# Altium schematic sheet Control.SchDoc
size A; Engineer: Will Snyder; Revision: 1.0; SheetNumber: 1; SheetTotal: 2; DocumentTItle: MCU, Power, and IO
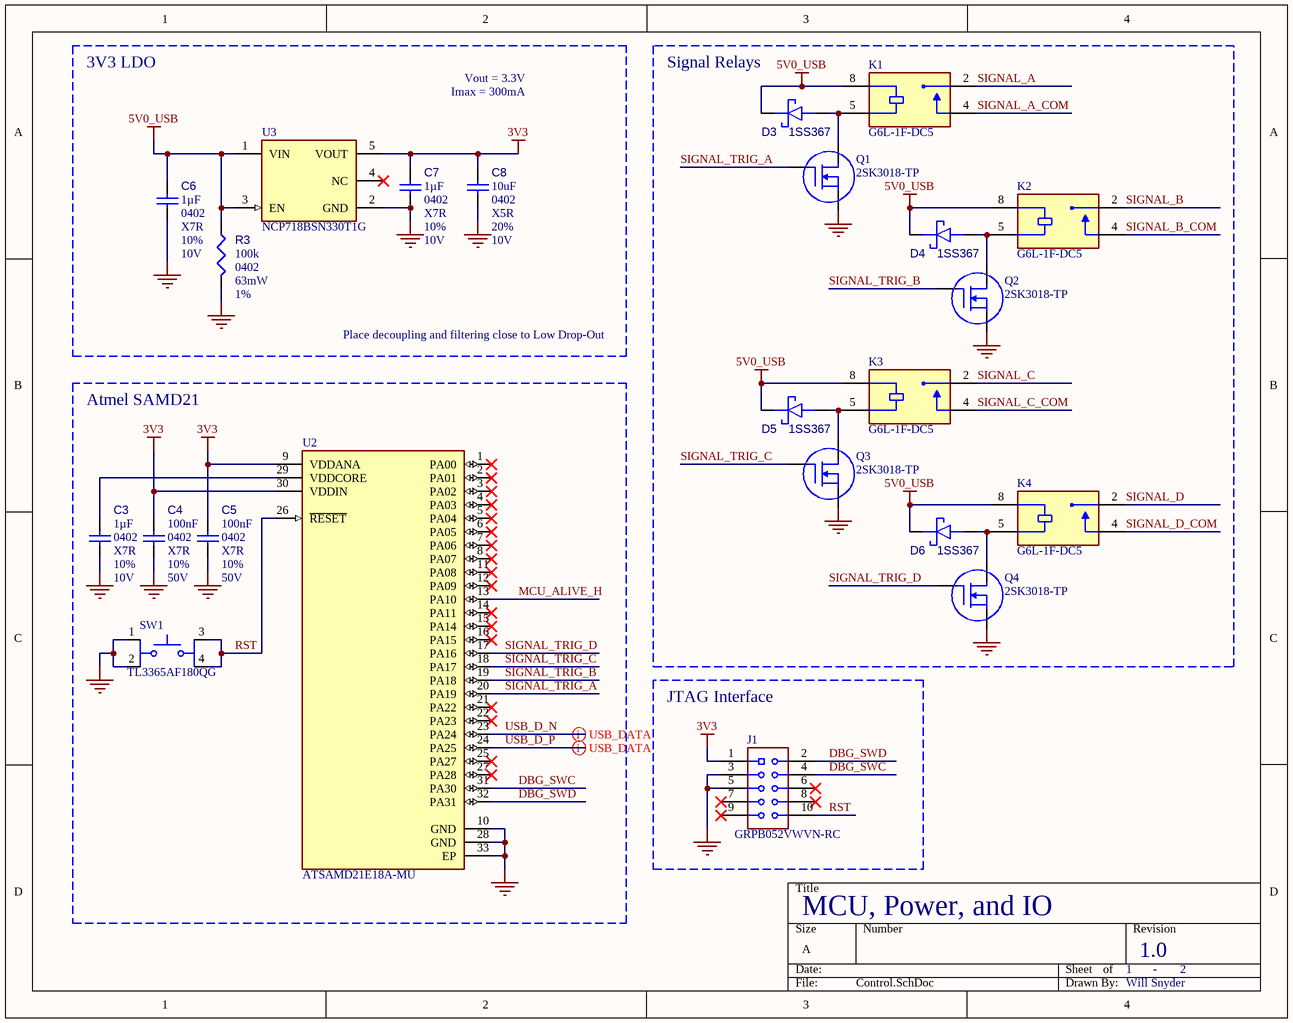
[diagram p0: Control.SchDoc]

## Parts
C3  value 1µF  Case/Package: 0402  Voltage Rating: 10V  Capacitor Type: X7R  Tolerance: 10%  [CAPC1005X55X30NL05T10]  (hidden comment: GRM155Z71A105KE01D)
C4  value 100nF  Voltage Rating: 50V  Capacitor Type: X7R  Case/Package: 0402  Tolerance: 10%  [CAPC1005X55X30NL05T10]  (hidden comment: 04025C104KAT4A)
C5  value 100nF  Voltage Rating: 50V  Capacitor Type: X7R  Case/Package: 0402  Tolerance: 10%  [CAPC1005X55X30NL05T10]  (hidden comment: 04025C104KAT4A)
C6  value 1µF  Case/Package: 0402  Voltage Rating: 10V  Capacitor Type: X7R  Tolerance: 10%  [CAPC1005X55X30NL05T10]  (hidden comment: GRM155Z71A105KE01D)
C7  value 1µF  Case/Package: 0402  Voltage Rating: 10V  Capacitor Type: X7R  Tolerance: 10%  [CAPC1005X55X30NL05T10]  (hidden comment: GRM155Z71A105KE01D)
C8  value 10uF  Capacitor Type: X5R  Voltage Rating: 10V  Tolerance: 20%  Case/Package: 0402  [CAPC1005X55X30NL05T10]  (hidden comment: GRM155R61A106ME11J)
D3  1SS367  [SOD2513X114N]
D4  1SS367  [SOD2513X114N]
D5  1SS367  [SOD2513X114N]
D6  1SS367  [SOD2513X114N]
J1  GRPB052VWVN-RC  [SULLINS_GRPB052VWVN-RC]
K1  G6L-1F-DC5  [RELAY_G6L-1F-DC5]
K2  G6L-1F-DC5  [RELAY_G6L-1F-DC5]
K3  G6L-1F-DC5  [RELAY_G6L-1F-DC5]
K4  G6L-1F-DC5  [RELAY_G6L-1F-DC5]
Q1  2SK3018-TP  [2SK3018-TP-Footprint-1]
Q2  2SK3018-TP  [2SK3018-TP-Footprint-1]
Q3  2SK3018-TP  [2SK3018-TP-Footprint-1]
Q4  2SK3018-TP  [2SK3018-TP-Footprint-1]
R3  value 100k  Power: 63mW  Case/Package: 0402  Tolerance: 1%  [RESC0402(1005)_L]  (hidden comment: 100KR2F)
SW1  TL3365AF180QG  [SW_TL3365AF180QG]
U2  ATSAMD21E18A-MU  [FP-PG-IPC_A]
U3  NCP718BSN330T1G  [SOT95P280X100-5N]

## Blocks framed on the sheet
3V3 LDO: C6-C8 R3 U3
Signal Relays: D3-D6 K1-K4 Q1-Q4
Atmel SAMD21: C3-C5 SW1 U2
JTAG Interface: J1

## Nets
3V3: C4.1 C5.1 C7.1 C8.1 J1.1 U2.9(VDDANA) U2.30(VDDIN) U3.5(VOUT)
5V0_USB: C6.1 D3.1(K) D4.1(K) D5.1(K) D6.1(K) K1.8(COIL1) K2.8(COIL1) K3.8(COIL1) K4.8(COIL1) R3.1 U3.1(VIN) U3.3(EN)
GND: C3.2 C4.2 C5.2 C6.2 C7.2 C8.2 J1.3 J1.5 Q1.2(S) Q2.2(S) Q3.2(S) Q4.2(S) R3.2 SW1.1 SW1.2 U2.10(GND) U2.28(GND) U2.33(EP) U3.2(GND)
DBG_SWC: J1.4 U2.31(PA30)
DBG_SWD: J1.2 U2.32(PA31)
MCU_ALIVE_H: U2.13(PA10)
RST: J1.10 SW1.3 SW1.4 U2.26(~{RESET})
SIGNAL_A: K1.2(COM)
SIGNAL_A_COM: K1.4(NO)
SIGNAL_B: K2.2(COM)
SIGNAL_B_COM: K2.4(NO)
SIGNAL_C: K3.2(COM)
SIGNAL_C_COM: K3.4(NO)
SIGNAL_D: K4.2(COM)
SIGNAL_D_COM: K4.4(NO)
SIGNAL_TRIG_A: Q1.1(G) U2.20(PA19)
SIGNAL_TRIG_B: Q2.1(G) U2.19(PA18)
SIGNAL_TRIG_C: Q3.1(G) U2.18(PA17)
SIGNAL_TRIG_D: Q4.1(G) U2.17(PA16)
USB_D_N: U2.23(PA24)
USB_D_P: U2.24(PA25)
NetC3_1: C3.1 U2.29(VDDCORE)
NetD3_2: D3.2(A) K1.5(COIL2) Q1.3(D)
NetD4_2: D4.2(A) K2.5(COIL2) Q2.3(D)
NetD5_2: D5.2(A) K3.5(COIL2) Q3.3(D)
NetD6_2: D6.2(A) K4.5(COIL2) Q4.3(D)

Not connected (* = marked no-connect by the designer): J1 6* 7* 8* 9*; U2 1(PA00)* 2(PA01)* 3(PA02)* 4(PA03)* 5(PA04)* 6(PA05)* 7(PA06)* 8(PA07)* 11(PA08)* 12(PA09)* 14(PA11)* 15(PA14)* 16(PA15)* 21(PA22)* 22(PA23)* 25(PA27)* 27(PA28)*; U3 4(NC)*

## Layout directives
differential pair: USB_D_N, USB_D_P

## Notes on the sheet
- Imax = 300mA
- Vout = 3.3V
- Place decoupling and filtering close to Low Drop-Out
- -

## Library data of the parts
C3 C6 C7 = CMP-001-00092-1: Ceramic Capacitor, Multilayer, Ceramic, 10V, 10% +Tol, 10% -Tol, X7R, 15% TC, 1uF, Surface Mount, 0402; Mounting Technology: Surface Mount; Max Operating Temperature: 125°C; Pins: 2; RoHS Compliant: Yes; Min Operating Temperature: -55°C
C4 C5 = CMP-001-00090-1: Ceramic Capacitor, Multilayer, Ceramic, 50V, 10% +Tol, 10% -Tol, X7R, 15% TC, 0.1uF, Surface Mount, 0402; Pins: 2; RoHS Compliant: Yes
C8 = CMP-001-00091-1: Ceramic Capacitor, Multilayer, Ceramic, 10V, 20% +Tol, 20% -Tol, X5R, 15% TC, 10uF, Surface Mount, 0402
D3-D6 = CMP-004-00052-1: Diode Schottky 10V 100mA USC; Forward Voltage: 500mV; Max Operating Temperature: 100°C; Min Operating Temperature: -40°C
J1 = CMP-002-00094-2: Connector Header Through Hole 10 position 0.050 (1.27mm); MF: Sullins; Price: None; Case/Package: None; SnapEDA_Link: https://www.snapeda.com/parts/GRPB052VWVN-RC/Sullins+Connector+Solutions/view-part/?ref=snap; MP: GRPB052VWVN-RC; Design Item ID: GRPB052VWVN-RC; Pins: 10; Value: *; Purchase-URL: https://pricing.snapeda.com/search/part/GRPB052VWVN-RC/?ref=eda; Source: GRPB052VWVN-RC.SchLib; Check_prices: https://www.snapeda.com/parts/GRPB052VWVN-RC/Sullins+Connector+Solutions/view-part/?ref=eda; Component Type: Standard; Availability: In Stock
K1-K4 = CMP-103-000000-1: Telecom Relay SPST-NO (1 Form A) Surface Mount; MP: G6L-1F-TR-DC5; MF: Omron Electronics; Component Type: Standard; Package: None; Value: *; Design Item ID: G6L-1F-DC5; Check_prices: https://www.snapeda.com/parts/G6L-1F-TR-DC5/Omron/view-part/?ref=eda; Pin Count: 4; SnapEDA_Link: https://www.snapeda.com/parts/G6L-1F-TR-DC5/Omron/view-part/?ref=snap; Source: G6L-1F-DC5.SchLib
Q1-Q4 = CMP-013-00044-1: Mosfet, N-Ch, 30V, 0.1A, Sot-323 Rohs Compliant: Yes
R3 = CMP-009-00064-2: 100K 0.063W 1% 0402 (1005 Metric)  SMD; Mounting Technology: SMT; Pins: 2
SW1 = CMP-011-00019-2: Tactile Switch SPST-NO Top Actuated Surface Mount; MF: E-Switch; MP: TL3365AF180QG; Case/Package: None; Availability: In Stock; SnapEDA_Link: https://www.snapeda.com/parts/TL3365AF180QG/E-Switch/view-part/?ref=snap; Check_prices: https://www.snapeda.com/parts/TL3365AF180QG/E-Switch/view-part/?ref=eda; Value: *; Pins: 4; Price: None; Purchase-URL: https://pricing.snapeda.com/search/part/TL3365AF180QG/?ref=eda; Component Type: Standard; Design Item ID: TL3365AF180QG; Source: TL3365AF180QG.SchLib
U2 = CMP-020-00023-1: RISC Microcontroller, 32-Bit, FLASH, CORTEX-M0 CPU, 48MHz, CMOS; Max Supply Voltage: 3.63V; Clock Frequency: 32MHz; Min Supply Voltage: 1.62V; Nominal Supply Voltage: 3.3V; RoHS Compliant: Yes; Max Operating Temperature: 85°C; Pins: 32; Case/Package: HVQCCN; Min Operating Temperature: -40°C
U3 = CMP-019-00058-1: Fixed Positive LDO Regulator, 3.3V, 440V Dropout, PDSO5; RoHS Compliant: Yes